# EAGLE schematic Brain (EAGLE 6.1)
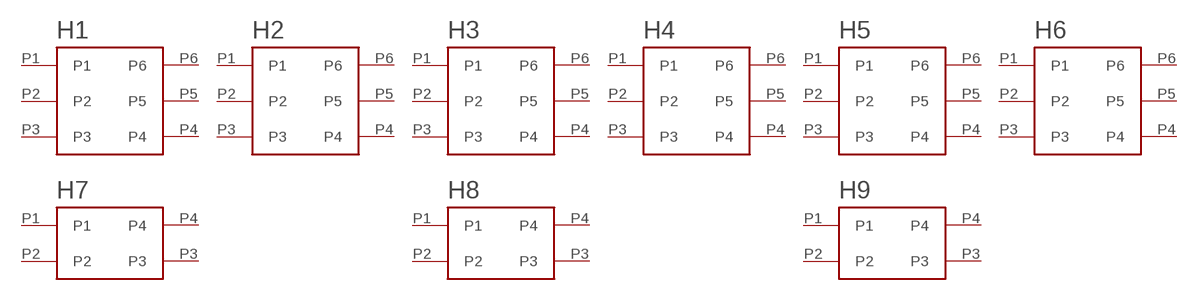
[diagram p0: schematic, sheet 1]

## Parts
H1  3X2F_1MM_SMD  [3X2F_1MM_SMD]
H2  3X2F_1MM_SMD  [3X2F_1MM_SMD]
H3  3X2F_1MM_SMD  [3X2F_1MM_SMD]
H4  3X2F_1MM_SMD  [3X2F_1MM_SMD]
H5  3X2F_1MM_SMD  [3X2F_1MM_SMD]
H6  3X2F_1MM_SMD  [3X2F_1MM_SMD]
H7  2X2F_1MM_SMD  [2X2F_1MM_SMD]
H8  2X2F_1MM_SMD  [2X2F_1MM_SMD]
H9  2X2F_1MM_SMD  [2X2F_1MM_SMD]
Unconnected: H1.P1 H1.P2 H1.P3 H1.P4 H1.P5 H1.P6 H2.P1 H2.P2 H2.P3 H2.P4 H2.P5 H2.P6 H3.P1 H3.P2 H3.P3 H3.P4 H3.P5 H3.P6 H4.P1 H4.P2 H4.P3 H4.P4 H4.P5 H4.P6 H5.P1 H5.P2 H5.P3 H5.P4 H5.P5 H5.P6 H6.P1 H6.P2 H6.P3 H6.P4 H6.P5 H6.P6 H7.P1 H7.P2 H7.P3 H7.P4 H8.P1 H8.P2 H8.P3 H8.P4 H9.P1 H9.P2 H9.P3 H9.P4

## Library data of the parts
H1-H6 = Customs:3X2
H7-H9 = Customs:2X2